# Altium project USB PD Hub.PrjPcb (part 2 of 2)

## Sheet USB7206C.SchDoc
size Tabloid; SheetNumber: 4; SheetTotal: 8
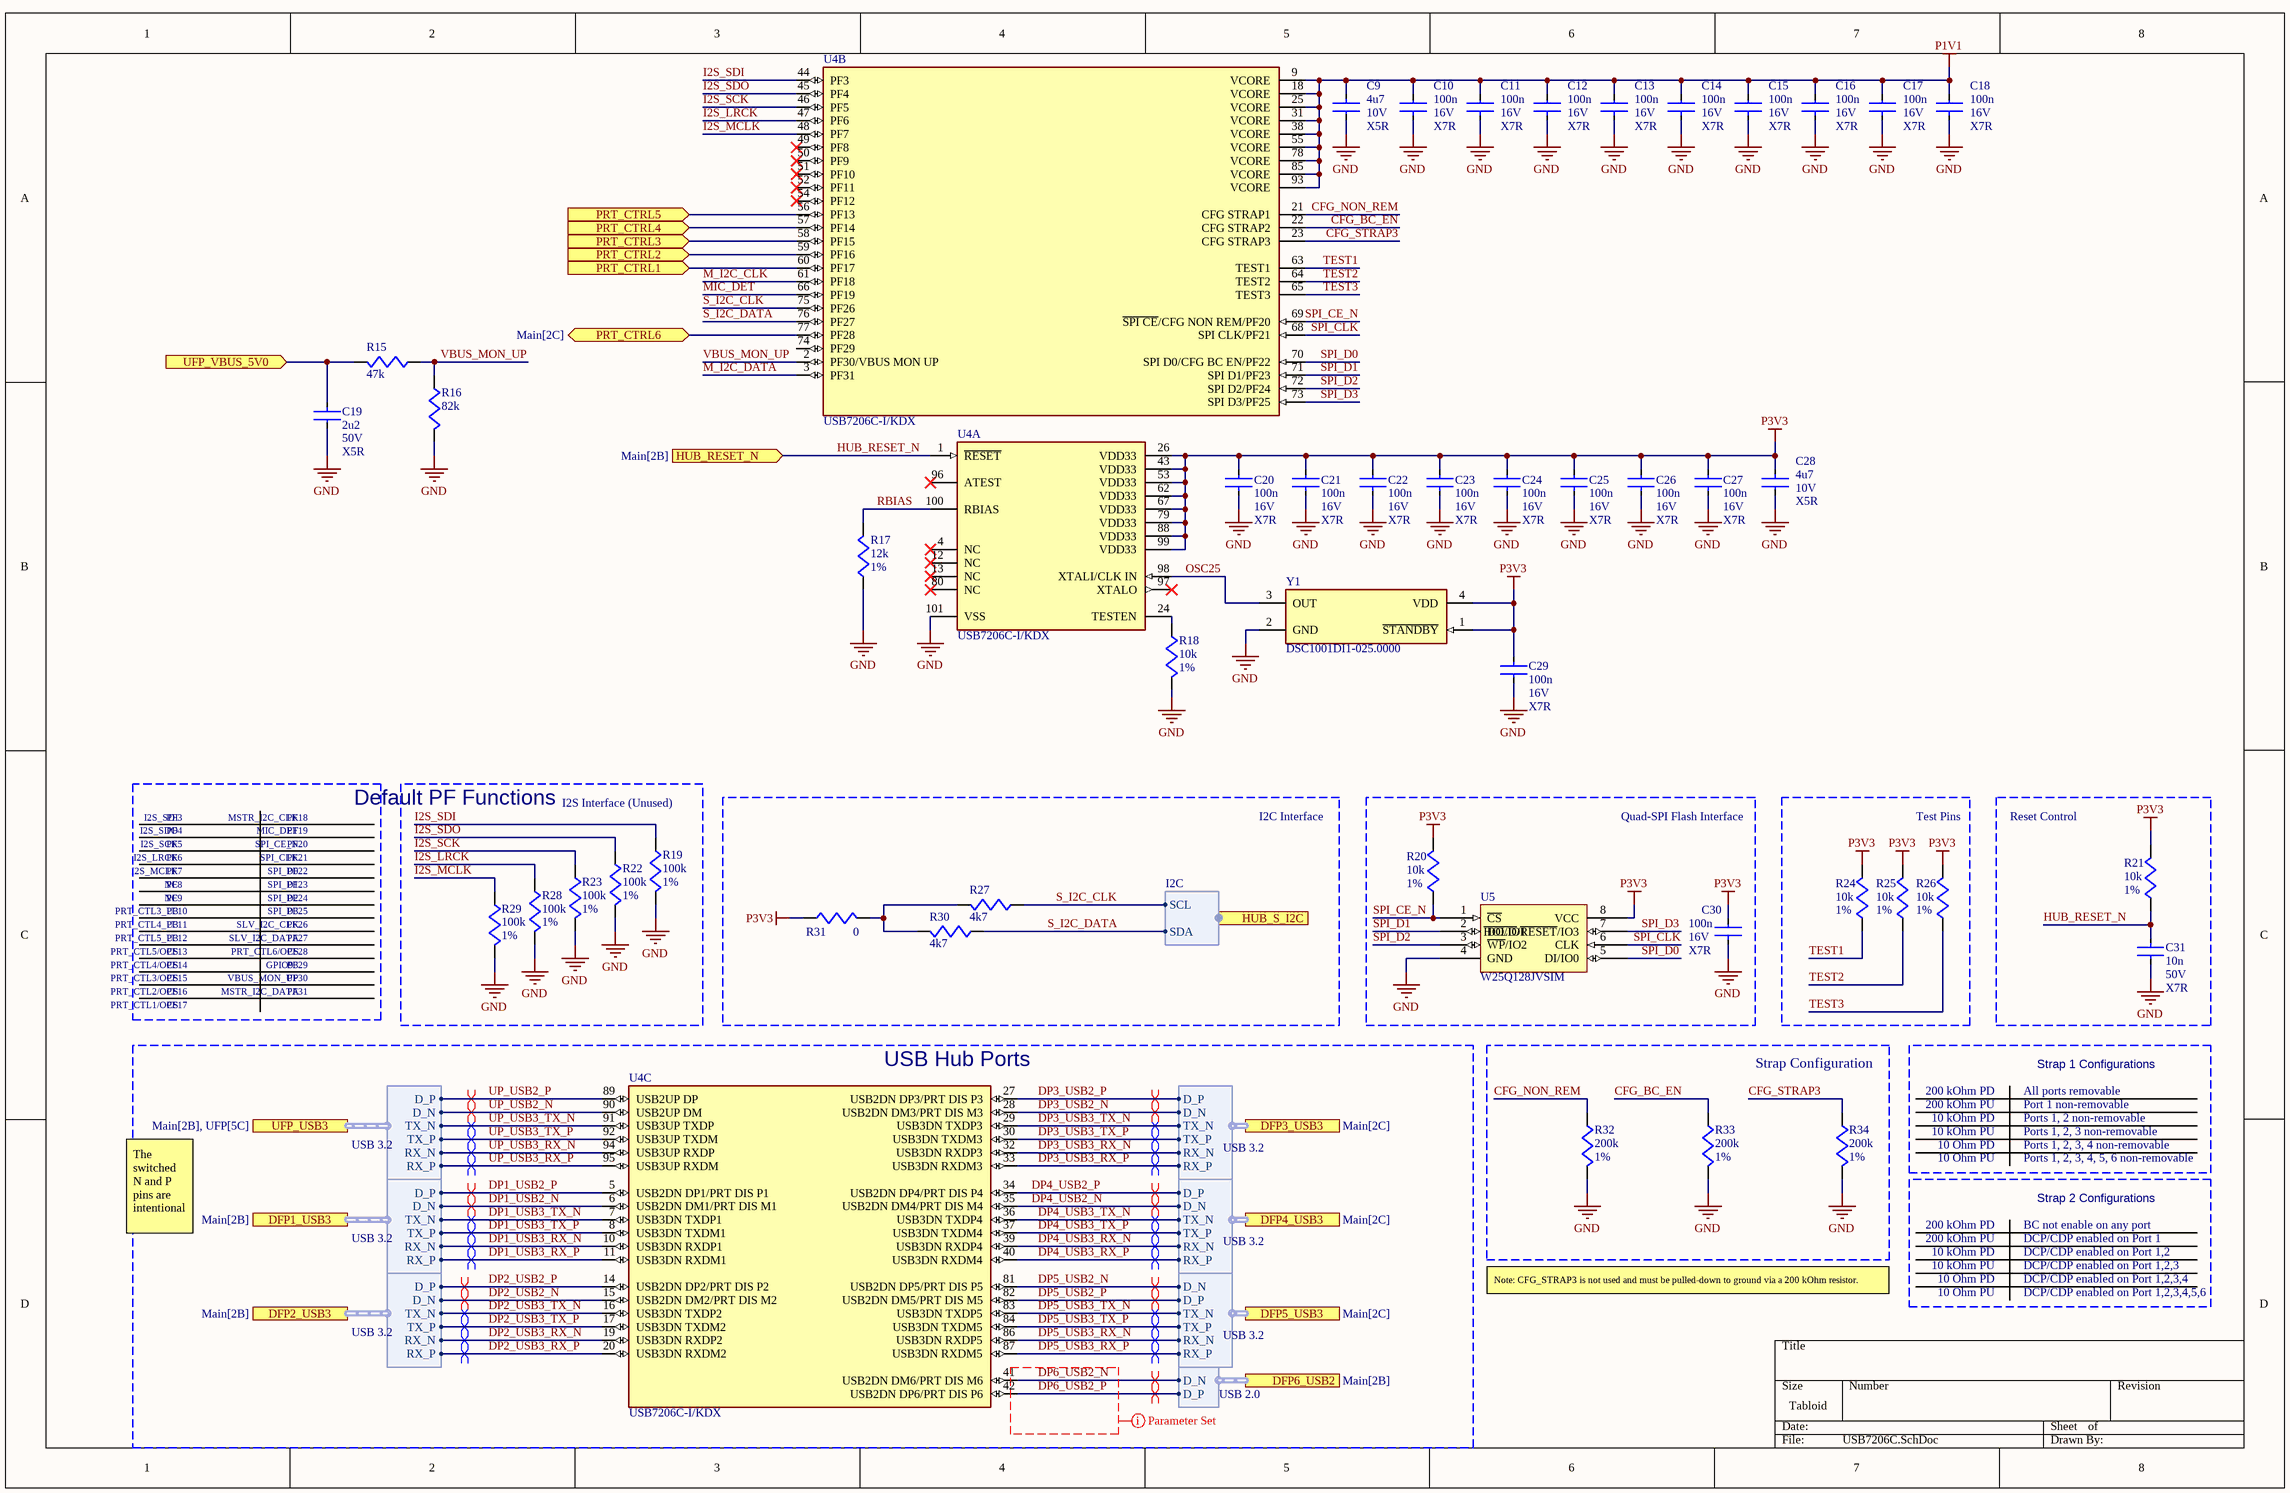
[diagram p6: USB7206C.SchDoc]

### Parts
C9  value 4u7  Voltage: 10V  Dielectric: X5R  [CAPC1005X06N]  (hidden comment: 4.7uF 10V 0402)
C10  value 100n  Voltage: 16V  Dielectric: X7R  [CAPC1005X06N]  (hidden comment: 100nF 16V 0402)
C11  value 100n  Voltage: 16V  Dielectric: X7R  [CAPC1005X06N]  (hidden comment: 100nF 16V 0402)
C12  value 100n  Voltage: 16V  Dielectric: X7R  [CAPC1005X06N]  (hidden comment: 100nF 16V 0402)
C13  value 100n  Voltage: 16V  Dielectric: X7R  [CAPC1005X06N]  (hidden comment: 100nF 16V 0402)
C14  value 100n  Voltage: 16V  Dielectric: X7R  [CAPC1005X06N]  (hidden comment: 100nF 16V 0402)
C15  value 100n  Voltage: 16V  Dielectric: X7R  [CAPC1005X06N]  (hidden comment: 100nF 16V 0402)
C16  value 100n  Voltage: 16V  Dielectric: X7R  [CAPC1005X06N]  (hidden comment: 100nF 16V 0402)
C17  value 100n  Voltage: 16V  Dielectric: X7R  [CAPC1005X06N]  (hidden comment: 100nF 16V 0402)
C18  value 100n  Voltage: 16V  Dielectric: X7R  [CAPC1005X06N]  (hidden comment: 100nF 16V 0402)
C19  value 2u2  Voltage: 50V  Dielectric: X5R  [CAPC2012X14N]  (hidden comment: 2.2uF 50V 0805)
C20  value 100n  Voltage: 16V  Dielectric: X7R  [CAPC1005X06N]  (hidden comment: 100nF 16V 0402)
C21  value 100n  Voltage: 16V  Dielectric: X7R  [CAPC1005X06N]  (hidden comment: 100nF 16V 0402)
C22  value 100n  Voltage: 16V  Dielectric: X7R  [CAPC1005X06N]  (hidden comment: 100nF 16V 0402)
C23  value 100n  Voltage: 16V  Dielectric: X7R  [CAPC1005X06N]  (hidden comment: 100nF 16V 0402)
C24  value 100n  Voltage: 16V  Dielectric: X7R  [CAPC1005X06N]  (hidden comment: 100nF 16V 0402)
C25  value 100n  Voltage: 16V  Dielectric: X7R  [CAPC1005X06N]  (hidden comment: 100nF 16V 0402)
C26  value 100n  Voltage: 16V  Dielectric: X7R  [CAPC1005X06N]  (hidden comment: 100nF 16V 0402)
C27  value 100n  Voltage: 16V  Dielectric: X7R  [CAPC1005X06N]  (hidden comment: 100nF 16V 0402)
C28  value 4u7  Voltage: 10V  Dielectric: X5R  [CAPC1005X06N]  (hidden comment: 4.7uF 10V 0402)
C29  value 100n  Voltage: 16V  Dielectric: X7R  [CAPC1005X06N]  (hidden comment: 100nF 16V 0402)
C30  value 100n  Voltage: 16V  Dielectric: X7R  [CAPC1005X06N]  (hidden comment: 100nF 16V 0402)
C31  value 10n  Voltage: 50V  Dielectric: X7R  [CAPC1005X06N]  (hidden comment: 10n 50V X7R 0402)
R15  value 47k  [RESC1005X04M]  (hidden comment: 47k 1% 0402)
R16  value 82k  [RESC1005X04M]  (hidden comment: 82k 1% 0402)
R17  value 12k  Tolerance: 1%  [RESC1005X04M]  (hidden comment: 12k 1% 0402)
R18  value 10k  Tolerance: 1%  [RESC1005X04M]  (hidden comment: 10k 1% 0402)
R19  value 100k  Tolerance: 1%  [RESC1005X04M]  (hidden comment: 100k 1% 0402)
R20  value 10k  Tolerance: 1%  [RESC1005X04M]  (hidden comment: 10k 1% 0402)
R21  value 10k  Tolerance: 1%  [RESC1005X04M]  (hidden comment: 10k 1% 0402)
R22  value 100k  Tolerance: 1%  [RESC1005X04M]  (hidden comment: 100k 1% 0402)
R23  value 100k  Tolerance: 1%  [RESC1005X04M]  (hidden comment: 100k 1% 0402)
R24  value 10k  Tolerance: 1%  [RESC1005X04M]  (hidden comment: 10k 1% 0402)
R25  value 10k  Tolerance: 1%  [RESC1005X04M]  (hidden comment: 10k 1% 0402)
R26  value 10k  Tolerance: 1%  [RESC1005X04M]  (hidden comment: 10k 1% 0402)
R27  value 4k7  [RESC1005X04M]  (hidden comment: 4.7k 5% 0402)
R28  value 100k  Tolerance: 1%  [RESC1005X04M]  (hidden comment: 100k 1% 0402)
R29  value 100k  Tolerance: 1%  [RESC1005X04M]  (hidden comment: 100k 1% 0402)
R30  value 4k7  [RESC1005X04M]  (hidden comment: 4.7k 5% 0402)
R31  value 0  [RESC1508X05M]  (hidden comment: 0 Ohm 1% 0603)
R32  value 200k  Tolerance: 1%  [RESC1005X04M]  (hidden comment: 200k 1% 0402)
R33  value 200k  Tolerance: 1%  [RESC1005X04M]  (hidden comment: 200k 1% 0402)
R34  value 200k  Tolerance: 1%  [RESC1005X04M]  (hidden comment: 200k 1% 0402)
U4  USB7206C-I/KDX  [FP-C04-407-IPC_A]  (parts A,B,C of 3)
U5  W25Q128JVSIM  [SOIC127P790X216-8N]
Y1  DSC1001DI1-025.0000  [FP-CDFN2520-4LD-PL-1-MFG]

### Blocks framed on the sheet
I2S Interface (Unused): R19 R22 R23 R28 R29
I2C Interface: R27 R30 R31
Quad-SPI Flash Interface: C30 R20 U5
Test Pins: R24-R26
Reset Control: C31 R21
USB Hub Ports: U4
Strap Configuration: R32-R34

### Ports
DFP1_USB3 (harness USB 3.2, see Main[2B]), DFP2_USB3 (harness USB 3.2, see Main[2B]), DFP3_USB3 (harness USB 3.2, see Main[2C]), DFP4_USB3 (harness USB 3.2, see Main[2C]), DFP5_USB3 (harness USB 3.2, see Main[2C]), DFP6_USB2 (harness USB 2.0, see Main[2B]), HUB_RESET_N (in, see Main[2B]), HUB_S_I2C (harness I2C, see Main[2B]), PRT_CTRL1 (in, see Main[2B]), PRT_CTRL2 (in, see Main[2B]), PRT_CTRL3 (in, see Main[2C]), PRT_CTRL4 (in, see Main[2C]), PRT_CTRL5 (in, see Main[2C]), PRT_CTRL6 (bidir, see Main[2C]), UFP_USB3 (harness USB 3.2, see Main[2B], UFP[5C]), UFP_VBUS_5V0 (in, see Main[2B], UFP[2B])

### Harnesses
USB 3.2: TX_N, TX_P, D_P, D_N, RX_N, RX_P
USB 3.2: TX_N, RX_N, TX_P, RX_P, D_N, D_P
USB 3.2: D_P, D_N, TX_N, RX_N, TX_P, RX_P
USB 3.2: D_P, D_N, TX_P, RX_P, RX_N, TX_N
USB 2.0: D_P, D_N
I2C: SCL, SDA
USB 3.2: D_N, TX_N, RX_N, TX_P, D_P, RX_P

### Nets
GND: C9.2 C10.1 C11.1 C12.1 C13.1 C14.1 C15.1 C16.1 C17.1 C18.1 C19.2 C20.1 C21.1 C22.1 C23.1 C24.1 C25.1 C26.1 C27.1 C28.2 C29.2 C30.1 C31.2 R16.1 R17.2 R18.1 R19.2 R22.2 R23.2 R28.2 R29.2 R32.2 R33.2 R34.2 U4.101(VSS) U5.4(GND) Y1.2(GND)
P1V1: C9.1 C10.2 C11.2 C12.2 C13.2 C14.2 C15.2 C16.2 C17.2 C18.2 U4.9(VCORE) U4.18(VCORE) U4.25(VCORE) U4.31(VCORE) U4.38(VCORE) U4.55(VCORE) U4.78(VCORE) U4.85(VCORE) U4.93(VCORE)
P3V3: C20.2 C21.2 C22.2 C23.2 C24.2 C25.2 C26.2 C27.2 C28.1 C29.1 C30.2 R20.2 R21.2 R24.2 R25.2 R26.2 R31.1 U4.26(VDD33) U4.43(VDD33) U4.53(VDD33) U4.62(VDD33) U4.67(VDD33) U4.79(VDD33) U4.88(VDD33) U4.99(VDD33) U5.8(VCC) Y1.1(~{STANDBY}) Y1.4(VDD)
P5V0_UFP: C19.1 R15.1 ; port UFP_VBUS_5V0
CFG_BC_EN: R33.1 U4.22(CFG_STRAP2)
CFG_NON_REM: R32.1 U4.21(CFG_STRAP1)
CFG_STRAP3: R34.1 U4.23(CFG_STRAP3)
DP1_USB2_N: U4.6(USB2DN_DM1/PRT_DIS_M1) ; port DFP1_USB3.D_N
DP1_USB2_P: U4.5(USB2DN_DP1/PRT_DIS_P1) ; port DFP1_USB3.D_P
DP1_USB3_RX_N: U4.10(USB3DN_RXDP1) ; port DFP1_USB3.RX_N
DP1_USB3_RX_P: U4.11(USB3DN_RXDM1) ; port DFP1_USB3.RX_P
DP1_USB3_TX_N: U4.7(USB3DN_TXDP1) ; port DFP1_USB3.TX_N
DP1_USB3_TX_P: U4.8(USB3DN_TXDM1) ; port DFP1_USB3.TX_P
DP2_USB2_N: U4.15(USB2DN_DM2/PRT_DIS_M2) ; port DFP2_USB3.D_N
DP2_USB2_P: U4.14(USB2DN_DP2/PRT_DIS_P2) ; port DFP2_USB3.D_P
DP2_USB3_RX_N: U4.19(USB3DN_RXDP2) ; port DFP2_USB3.RX_N
DP2_USB3_RX_P: U4.20(USB3DN_RXDM2) ; port DFP2_USB3.RX_P
DP2_USB3_TX_N: U4.16(USB3DN_TXDP2) ; port DFP2_USB3.TX_N
DP2_USB3_TX_P: U4.17(USB3DN_TXDM2) ; port DFP2_USB3.TX_P
DP3_USB2_N: U4.28(USB2DN_DM3/PRT_DIS_M3) ; port DFP3_USB3.D_N
DP3_USB2_P: U4.27(USB2DN_DP3/PRT_DIS_P3) ; port DFP3_USB3.D_P
DP3_USB3_RX_N: U4.32(USB3DN_RXDP3) ; port DFP3_USB3.RX_N
DP3_USB3_RX_P: U4.33(USB3DN_RXDM3) ; port DFP3_USB3.RX_P
DP3_USB3_TX_N: U4.29(USB3DN_TXDP3) ; port DFP3_USB3.TX_N
DP3_USB3_TX_P: U4.30(USB3DN_TXDM3) ; port DFP3_USB3.TX_P
DP4_USB2_N: U4.35(USB2DN_DM4/PRT_DIS_M4) ; port DFP4_USB3.D_N
DP4_USB2_P: U4.34(USB2DN_DP4/PRT_DIS_P4) ; port DFP4_USB3.D_P
DP4_USB3_RX_N: U4.39(USB3DN_RXDP4) ; port DFP4_USB3.RX_N
DP4_USB3_RX_P: U4.40(USB3DN_RXDM4) ; port DFP4_USB3.RX_P
DP4_USB3_TX_N: U4.36(USB3DN_TXDP4) ; port DFP4_USB3.TX_N
DP4_USB3_TX_P: U4.37(USB3DN_TXDM4) ; port DFP4_USB3.TX_P
DP5_USB2_N: U4.81(USB2DN_DP5/PRT_DIS_P5) ; port DFP5_USB3.D_N
DP5_USB2_P: U4.82(USB2DN_DM5/PRT_DIS_M5) ; port DFP5_USB3.D_P
DP5_USB3_RX_N: U4.86(USB3DN_RXDP5) ; port DFP5_USB3.RX_N
DP5_USB3_RX_P: U4.87(USB3DN_RXDM5) ; port DFP5_USB3.RX_P
DP5_USB3_TX_N: U4.83(USB3DN_TXDP5) ; port DFP5_USB3.TX_N
DP5_USB3_TX_P: U4.84(USB3DN_TXDM5) ; port DFP5_USB3.TX_P
DP6_USB2_N: U4.41(USB2DN_DM6/PRT_DIS_M6) ; port DFP6_USB2.D_N
DP6_USB2_P: U4.42(USB2DN_DP6/PRT_DIS_P6) ; port DFP6_USB2.D_P
FAULT: U4.60(PF17) ; port PRT_CTRL1
FAULT: U4.59(PF16) ; port PRT_CTRL2  [a separate net that carries the same name]
FAULT: U4.58(PF15) ; port PRT_CTRL3  [a separate net that carries the same name]
FAULT: U4.57(PF14) ; port PRT_CTRL4  [a separate net that carries the same name]
HUB_RESET_N: C31.1 R21.1 U4.1(~{RESET}) ; port HUB_RESET_N
I2S_LRCK: R28.1 U4.47(PF6)
I2S_MCLK: R29.1 U4.48(PF7)
I2S_SCK: R23.1 U4.46(PF5)
I2S_SDI: R19.1 U4.44(PF3)
I2S_SDO: R22.1 U4.45(PF4)
M_I2C_CLK: U4.61(PF18)
M_I2C_DATA: U4.3(PF31)
MIC_DET: U4.66(PF19)
OSC25: U4.98(XTALI/CLK_IN) Y1.3(OUT)
RBIAS: R17.1 U4.100(RBIAS)
S_I2C_CLK: R27.1 U4.75(PF26) ; port HUB_S_I2C.SCL
S_I2C_DATA: R30.1 U4.76(PF27) ; port HUB_S_I2C.SDA
SPI_CE_N: R20.1 U4.69(~{SPI_CE}/CFG_NON_REM/PF20) U5.1(~{CS})
SPI_CLK: U4.68(SPI_CLK/PF21) U5.6(CLK)
SPI_D0: U4.70(SPI_D0/CFG_BC_EN/PF22) U5.5(DI/IO0)
SPI_D1: U4.71(SPI_D1/PF23) U5.2(DO/IO1)
SPI_D2: U4.72(SPI_D2/PF24) U5.3(~{WP}/IO2)
SPI_D3: U4.73(SPI_D3/PF25) U5.7(~{HOLD}/~{RESET}/IO3)
TEST1: R24.1 U4.63(TEST1)
TEST2: R25.1 U4.64(TEST2)
TEST3: R26.1 U4.65(TEST3)
UP_USB2_N: U4.90(USB2UP_DM) ; port UFP_USB3.D_N
UP_USB2_P: U4.89(USB2UP_DP) ; port UFP_USB3.D_P
UP_USB3_RX_N: U4.94(USB3UP_RXDP) ; port UFP_USB3.RX_N
UP_USB3_RX_P: U4.95(USB3UP_RXDM) ; port UFP_USB3.RX_P
UP_USB3_TX_N: U4.91(USB3UP_TXDP) ; port UFP_USB3.TX_N
UP_USB3_TX_P: U4.92(USB3UP_TXDM) ; port UFP_USB3.TX_P
VBUS_MON_UP: R15.2 R16.2 U4.2(PF30/VBUS_MON_UP)
NetR18_2: R18.2 U4.24(TESTEN)
NetR27_2: R27.2 R30.2 R31.2
NetU4_56: U4.56(PF13) ; port PRT_CTRL5
NetU4_77: U4.77(PF28) ; port PRT_CTRL6

Not connected (* = marked no-connect by the designer): U4 4(NC)* 12(NC)* 13(NC)* 49(PF8)* 50(PF9)* 51(PF10)* 52(PF11)* 54(PF12)* 74(PF29) 80(NC)* 96(ATEST)* 97(XTALO)*

### Layout directives
differential pair; differential pair class DIFF90: DP1_USB2_N, DP1_USB2_P, DP1_USB3_RX_N, DP1_USB3_RX_P, DP1_USB3_TX_N, DP1_USB3_TX_P, DP2_USB2_N, DP2_USB2_P, DP2_USB3_RX_N, DP2_USB3_RX_P, DP2_USB3_TX_N, DP2_USB3_TX_P, DP3_USB2_N, DP3_USB2_P, DP3_USB3_RX_N, DP3_USB3_RX_P, DP3_USB3_TX_N, DP3_USB3_TX_P, DP4_USB2_N, DP4_USB2_P, DP4_USB3_RX_N, DP4_USB3_RX_P, DP4_USB3_TX_N, DP4_USB3_TX_P, DP5_USB2_N, DP5_USB2_P, DP5_USB3_RX_N, DP5_USB3_RX_P, DP5_USB3_TX_N, DP5_USB3_TX_P, DP6_USB2_N, DP6_USB2_P, UP_USB2_N, UP_USB2_P, UP_USB3_RX_N, UP_USB3_RX_P, UP_USB3_TX_N, UP_USB3_TX_P
net class USB2: DP6_USB2_N, DP6_USB2_P

### Notes on the sheet
- PF4
- PF5
- PF3
- I2S_SCK
- I2S_SDO
- I2S_SDI
- PF19
- PF20
- PF18
- MSTR_I2C_CLK
- MIC_DET
- SPI_CE_N
- Default PF Functions
- PF7
- PF8
- PF9
- PF6
- I2S_LRCK
- I2S_MCLK
- NC
- PF21
- PF23
- PF24
- PF22
- SPI_CLK
- SPI_D0
- SPI_D1
- SPI_D2
- PF11
- PF12
- PF13
- PF15
- PF14
- PF10
- PRT_CTL3_U3
- PRT_CTL4_U3
- PRT_CTL5_U3
- PRT_CTL5/OCS
- PRT_CTL4/OCS
- PRT_CTL3/OCS
- PF26
- PF27
- PF28
- PF30
- PF29
- PF25
- SPI_D3
- SLV_I2C_CLK
- SLV_I2C_DATA
- PRT_CTL6/OCS
- GPIO93
- VBUS_MON_UP
- PF16
- PF17
- PRT_CTL1/OCS
- PRT_CTL2/OCS
- PF31
- MSTR_I2C_DATA
- 200 kOhm PD
- 200 kOhm PU
- All ports removable
- Port 1 non-removable
- Strap 1 Configurations
- 10 kOhm PD
- 10 kOhm PU
- 10 Ohm PD
- 10 Ohm PU
- Ports 1, 2 non-removable
- Ports 1, 2, 3 non-removable
- Ports 1, 2, 3, 4 non-removable
- Ports 1, 2, 3, 4, 5, 6 non-removable
- The switched N and P pins are intentional
- BC not enable on any port
- DCP/CDP enabled on Port 1
- Strap 2 Configurations
- Note: CFG_STRAP3 is not used and must be pulled-down to ground via a 200 kOhm resistor.
- DCP/CDP enabled on Port 1,2
- DCP/CDP enabled on Port 1,2,3
- DCP/CDP enabled on Port 1,2,3,4
- DCP/CDP enabled on Port 1,2,3,4,5,6

### Library data of the parts
C9 C28 = CMP-001-00117-1: 10V 4.7uF X5R ±10% 0402 Multilayer Ceramic Capacitors MLCC - SMD/SMT ROHS; LCSC Part #: C368809; Package: 0402
C10-C18 C20-C27 C29 C30 = CMP-001-00088-1: 16V 100nF X7R ±10% 0402 Multilayer Ceramic Capacitors MLCC - SMD/SMT ROHS; LCSC Part #: C1525; Package: 0402
C19 = CMP-001-00094-2: 50V 2.2uF X5R ±10% 0805 Multilayer Ceramic Capacitors MLCC - SMD/SMT ROHS; Package: 0805; LCSC Part #: C377773
C31 = CMP-001-00116-1: 50V 10nF X7R ±10% 0402 Multilayer Ceramic Capacitors MLCC - SMD/SMT ROHS; LCSC Part #: C60133; Package: 0402
R15 = CMP-009-00226-1: 62.5mW Thick Film Resistors 50V ±100ppm/℃ ±5% 47kΩ 0402 Chip Resistor - Surface Mount ROHS; Tolerance: 1%; LCSC Part #: C163440; Package: 0402
R16 = CMP-009-00227-1: 62.5mW Thick Film Resistors 50V ±100ppm/℃ ±1% 82kΩ 0402 Chip Resistor - Surface Mount ROHS; Tolerance: 1%; LCSC Part #: C137932; Package: 0402
R17 = CMP-009-00219-1: 62.5mW Thick Film Resistors 50V ±100ppm/℃ ±1% 12kΩ 0402 Chip Resistor - Surface Mount ROHS; LCSC Part #: C114760; Package: 0402
R18 R20 R21 R24-R26 = CMP-009-00187-1: 62.5mW Thick Film Resistors 50V ±100ppm/℃ ±1% 10kΩ 0402 Chip Resistor - Surface Mount ROHS; LCSC Part #: C60490; Package: 0402
R19 R22 R23 R28 R29 = CMP-009-00218-1: 62.5mW Thick Film Resistors 50V ±100ppm/℃ ±1% 100kΩ 0402 Chip Resistor - Surface Mount ROHS; LCSC Part #: C60491; Package: 0402
R27 R30 = CMP-009-00197-1: 62.5mW Thick Film Resistors 50V ±100ppm/℃ ±5% 4.7kΩ 0402 Chip Resistor - Surface Mount ROHS; Tolerance: 5%; Package: 0402; LCSC Part #: C105870
R31 = CMP-009-00190-2: 62.5mW Thick Film Resistors 50V 0Ω 0402 Chip Resistor - Surface Mount ROHS; Tolerance: 1%; Package: 0603; LCSC Part #: C60485
R32-R34 = CMP-009-00220-1: 62.5mW Thick Film Resistors 50V ±100ppm/℃ ±1% 200kΩ 0402 Chip Resistor - Surface Mount ROHS; Populated: Yes; Package: 0402; LCSC Part #: C114763
U4 = CMP-001-0012-2: USB3.1 GEN2 Hub_no Pd_no Type C 100 VQFN 12X12X0.9MM Tray Rohs Compliant: Yes; Interface: I2C,SPI,USB,I2S,SMBus; Max Supply Voltage: 3.6V; Min Supply Voltage: 1.09V; Max Operating Temperature: 85°C; Min Operating Temperature: -40°C; Height: 900um
U5 = CMP-019-00052-3: NOR Flash Serial (SPI, Dual SPI, Quad SPI) 3V/3.3V 128M-bit 16M x 8 6ns 8-Pin SOIC Tube
Y1 = CMP-06255-000046-1: MEMS OSC XO 25.0000MHZ CMOS SMD; Max Supply Current: 6.3mA; Load Capacitance: 15pF; Max Duty Cycle: 55%; Min Supply Voltage: 1.7V; Frequency Stability: 50ppm; Frequency: 25MHz; Operating Supply Voltage: 3.3V; Max Supply Voltage: 3.6V; Packaging: Rail/Tube; RoHS Compliant: Yes; Length: 0.098inch; Ratings: AEC-Q100; Mount: Surface Mount; Case/Package: SMD/SMT; Width: 0.079inch; Package Quantity: 140; Min Operating Temperature: -40°C; Max Operating Temperature: 85°C; Series: DSC1001; Termination: Solder; Height: 0.035inch

## Sheet PowerSheet.SchDoc
size B; SheetNumber: 2; SheetTotal: 8
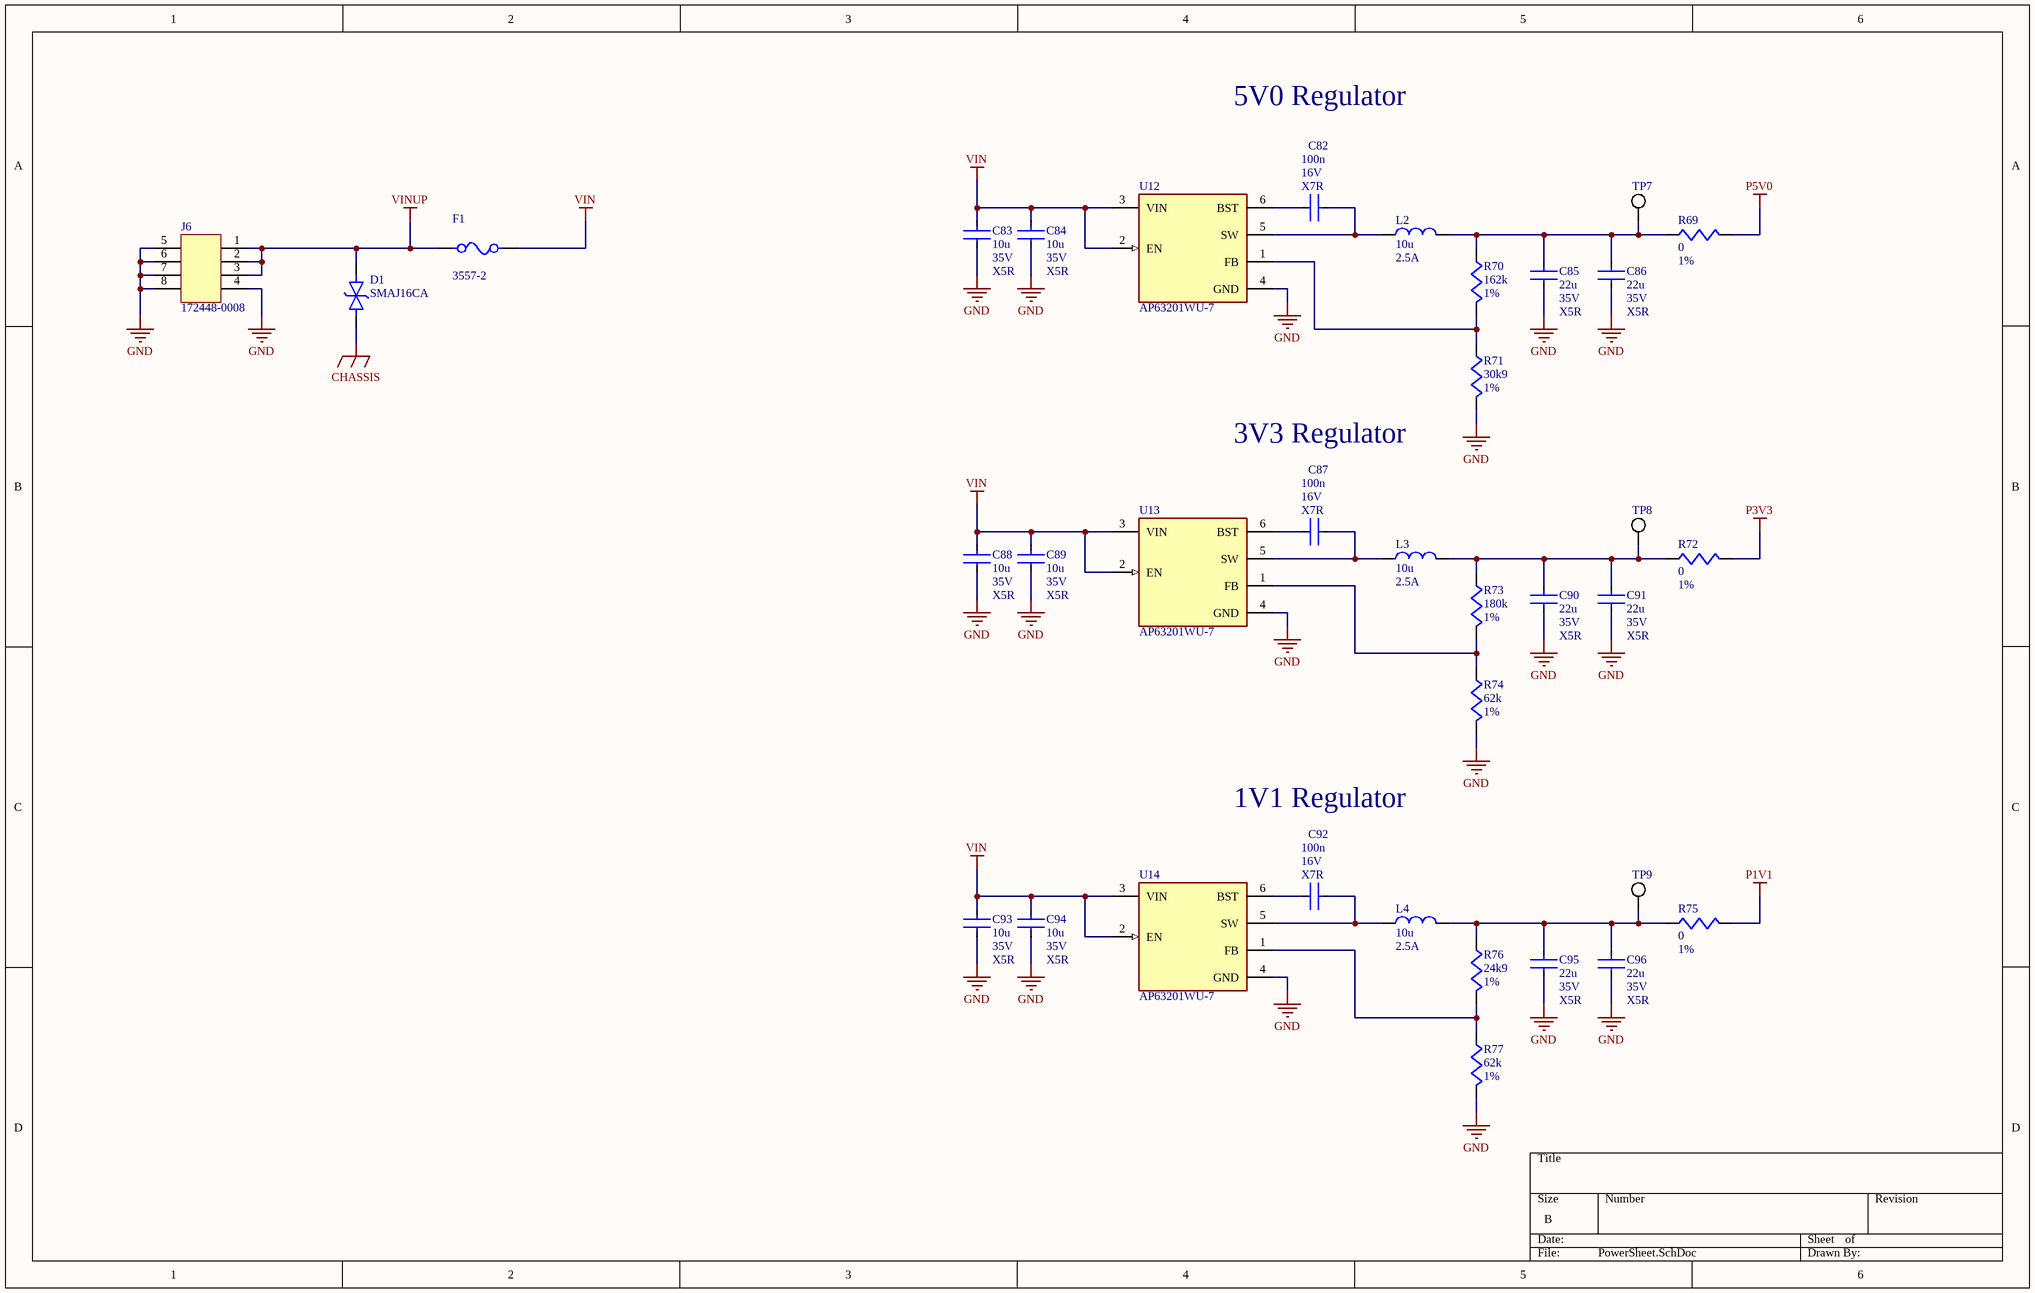
[diagram p7: PowerSheet.SchDoc]

### Parts
C82  value 100n  Voltage: 16V  Dielectric: X7R  [CAPC1005X06N]  (hidden comment: 100nF 16V 0402)
C83  value 10u  Voltage: 35V  Dielectric: X5R  [CAPC1608X08N]  (hidden comment: 10uF 35V 0603)
C84  value 10u  Voltage: 35V  Dielectric: X5R  [CAPC1608X08N]  (hidden comment: 10uF 35V 0603)
C85  value 22u  Voltage: 35V  Dielectric: X5R  [CAPC3225X18N]  (hidden comment: 22uF 35V 1210 X5R)
C86  value 22u  Voltage: 35V  Dielectric: X5R  [CAPC3225X18N]  (hidden comment: 22uF 35V 1210 X5R)
C87  value 100n  Voltage: 16V  Dielectric: X7R  [CAPC1005X06N]  (hidden comment: 100nF 16V 0402)
C88  value 10u  Voltage: 35V  Dielectric: X5R  [CAPC1608X08N]  (hidden comment: 10uF 35V 0603)
C89  value 10u  Voltage: 35V  Dielectric: X5R  [CAPC1608X08N]  (hidden comment: 10uF 35V 0603)
C90  value 22u  Voltage: 35V  Dielectric: X5R  [CAPC3225X18N]  (hidden comment: 22uF 35V 1210 X5R)
C91  value 22u  Voltage: 35V  Dielectric: X5R  [CAPC3225X18N]  (hidden comment: 22uF 35V 1210 X5R)
C92  value 100n  Voltage: 16V  Dielectric: X7R  [CAPC1005X06N]  (hidden comment: 100nF 16V 0402)
C93  value 10u  Voltage: 35V  Dielectric: X5R  [CAPC1608X08N]  (hidden comment: 10uF 35V 0603)
C94  value 10u  Voltage: 35V  Dielectric: X5R  [CAPC1608X08N]  (hidden comment: 10uF 35V 0603)
C95  value 22u  Voltage: 35V  Dielectric: X5R  [CAPC3225X18N]  (hidden comment: 22uF 35V 1210 X5R)
C96  value 22u  Voltage: 35V  Dielectric: X5R  [CAPC3225X18N]  (hidden comment: 22uF 35V 1210 X5R)
D1  SMAJ16CA  [DO-214AC]
F1  3557-2  [3557-2-Footprint-1]
J6  172448-0008  [FP-172448-0008-MFG]
L2  value 10u  Saturation Current: 2.5A  [10uH 2.5A SL0420-100M-Footprint-1]  (hidden comment: 10uH 2.5A SL0420-100M)
L3  value 10u  Saturation Current: 2.5A  [10uH 2.5A SL0420-100M-Footprint-1]  (hidden comment: 10uH 2.5A SL0420-100M)
L4  value 10u  Saturation Current: 2.5A  [10uH 2.5A SL0420-100M-Footprint-1]  (hidden comment: 10uH 2.5A SL0420-100M)
R69  value 0  Tolerance: 1%  [RESC2013X06M]  (hidden comment: 0 Ohm 1% 0805)
R70  value 162k  Tolerance: 1%  [RESC1005X04M]  (hidden comment: 162k 1% 0402)
R71  value 30k9  Tolerance: 1%  [RESC1005X04M]  (hidden comment: 30.9k 1% 0402)
R72  value 0  Tolerance: 1%  [RESC2013X06M]  (hidden comment: 0 Ohm 1% 0805)
R73  value 180k  Tolerance: 1%  [RESC1005X04M]  (hidden comment: 180k 1% 0402)
R74  value 62k  Tolerance: 1%  [RESC1005X04M]  (hidden comment: 62k 1% 0402)
R75  value 0  Tolerance: 1%  [RESC2013X06M]  (hidden comment: 0 Ohm 1% 0805)
R76  value 24k9  Tolerance: 1%  [RESC1005X04M]  (hidden comment: 24.9k 1% 0402)
R77  value 62k  Tolerance: 1%  [RESC1005X04M]  (hidden comment: 62k 1% 0402)
TP7  SMT Test Point 5015  [New footprint 1]  (value not drawn)
TP8  SMT Test Point 5015  [New footprint 1]  (value not drawn)
TP9  SMT Test Point 5015  [New footprint 1]  (value not drawn)
U12  AP63201WU-7  [FP-TSOT26-IPC_B]
U13  AP63201WU-7  [FP-TSOT26-IPC_B]
U14  AP63201WU-7  [FP-TSOT26-IPC_B]

### Nets
CHASSIS: D1.2
GND: C83.2 C84.2 C85.2 C86.2 C88.2 C89.2 C90.2 C91.2 C93.2 C94.2 C95.2 C96.2 J6.4 J6.5 J6.6 J6.7 J6.8 R71.2 R74.2 R77.2 U12.4(GND) U13.4(GND) U14.4(GND)
P1V1: R75.2
P3V3: R72.2
P5V0: R69.2
VIN: C83.1 C84.1 C88.1 C89.1 C93.1 C94.1 F1.2 U12.2(EN) U12.3(VIN) U13.2(EN) U13.3(VIN) U14.2(EN) U14.3(VIN)
VINUP: D1.1 F1.1 J6.1 J6.2 J6.3
NetC82_1: C82.1 L2.1 U12.5(SW)
NetC82_2: C82.2 U12.6(BST)
NetC85_1: C85.1 C86.1 L2.2 R69.1 R70.1 TP7.0
NetC87_1: C87.1 L3.1 U13.5(SW)
NetC87_2: C87.2 U13.6(BST)
NetC90_1: C90.1 C91.1 L3.2 R72.1 R73.1 TP8.0
NetC92_1: C92.1 L4.1 U14.5(SW)
NetC92_2: C92.2 U14.6(BST)
NetC95_1: C95.1 C96.1 L4.2 R75.1 R76.1 TP9.0
NetR70_2: R70.2 R71.1 U12.1(FB)
NetR73_2: R73.2 R74.1 U13.1(FB)
NetR76_2: R76.2 R77.1 U14.1(FB)

### Notes on the sheet
- 5V0 Regulator
- 3V3 Regulator
- 1V1 Regulator

### Library data of the parts
C82 C87 C92 = CMP-001-00088-2: 16V 100nF X7R ±10% 0402 Multilayer Ceramic Capacitors MLCC - SMD/SMT ROHS; LCSC Part #: C1525; Package: 0402
C83 C84 C88 C89 C93 C94 = CMP-001-00102-2: 35V 10uF X5R ±20% 0603 Multilayer Ceramic Capacitors MLCC - SMD/SMT ROHS; LCSC Part #: C194427; Package: 0603
C85 C86 C90 C91 C95 C96 = CMP-001-00092-2: 35V 22uF X5R ±20% 1210 Multilayer Ceramic Capacitors MLCC - SMD/SMT ROHS; Package: 1210; LCSC Part #: C778721
D1 = CMP-004-00043-1: 26V 17.8V Bidirectional 16V SMA(DO-214AC) ESD and Surge Protection (TVS/ESD) ROHS
F1 = CMP-00030-00001-1: Fuse Block 30 A 500V 1 Circuit Blade Through Hole; LCSC Part #: C19727304
J6 = CMP-002-00125-2: Rectangular Power Connector, 8 Contact(s), Male, Solder Terminal; Connector Type: Power,Rectangular; RoHS Compliant: Yes; Mounting Technology: Board
L2-L4 = CMP-006-00023-1: 2A 10uH ±20% 2.5A SMD,4.5x4.1mm Inductors (SMD) ROHS; Footprint: 4.5mmx4.1mm
R69 R72 R75 = CMP-009-00237-1: 125mW Thick Film Resistors 150V ±5% 0Ω 0805 Chip Resistor - Surface Mount ROHS; LCSC Part #: C96345; Package: 0805
R70 = CMP-009-00217-3: 62.5mW Thick Film Resistors 50V ±100ppm/℃ ±1% 162kΩ 0402 Chip Resistor - Surface Mount ROHS; LCSC Part #: C54068; Package: 0402
R71 = CMP-009-00214-2: 62.5mW Thick Film Resistors 50V ±100ppm/℃ ±1% 30.9kΩ 0402 Chip Resistor - Surface Mount ROHS; LCSC Part #: C185428; Package: 0402
R73 = CMP-009-00238-1: 62.5mW Thick Film Resistors 50V ±100ppm/℃ ±1% 180kΩ 0402 Chip Resistor - Surface Mount ROHS; LCSC Part #: C144794; Package: 0402
R74 R77 = CMP-009-00239-1: 62.5mW Thick Film Resistors 50V ±100ppm/℃ ±1% 62kΩ 0402 Chip Resistor - Surface Mount ROHS; LCSC Part #: C137950; Package: 0402
R76 = CMP-009-00200-2: 62.5mW Thick Film Resistors 50V ±100ppm/℃ ±1% 24.9kΩ 0402 Chip Resistor - Surface Mount ROHS; LCSC Part #: C25874; Package: 0402
TP7-TP9 = CMP-00030-00002-1: PC Test Point, Miniature Phosphor Bronze Silver Plating Surface Mount Mounting Type; LCSC Part #: C5199798
U12-U14 = CMP-019-00068-1: Switching Regulator; LCSC Part #: C2071044

## Nets that join several sheets
CHASSIS: Main (C8.1 J2.Shell R14.2 U3.2), PORT1 (6 pins), PORT2 (6 pins), PORT3 (6 pins), PORT4 (6 pins), UFP (7 pins), PowerSheet (D1.2)
GND: Main (6 pins), PORT1 (22 pins), PORT1/PD Controller (25 pins), PORT1/PD Regulator (30 pins), PORT2 (22 pins), PORT2/PD Controller (25 pins), PORT2/PD Regulator (30 pins), PORT3 (22 pins), PORT3/PD Controller (25 pins), PORT3/PD Regulator (30 pins), PORT4 (22 pins), PORT4/PD Controller (25 pins), PORT4/PD Regulator (30 pins), UFP (15 pins), STM32F070CBT6 (18 pins), USB7206C (37 pins), PowerSheet (23 pins)
P1V1: USB7206C (19 pins), PowerSheet (R75.2)
P3V3: Main (R9.2 R11.2 R13.2), PORT1 (7 pins), PORT1/PD Controller (R38A.1 U8A.10), PORT2 (7 pins), PORT2/PD Controller (R38B.1), PORT3 (7 pins), PORT3/PD Controller (R38C.1), PORT4 (7 pins), PORT4/PD Controller (R38D.1), UFP (C1.2 R1.2 U2.8), STM32F070CBT6 (11 pins), USB7206C (28 pins), PowerSheet (R72.2)
P5V0: Main (F2.2), PORT1/PD Controller (C45A.1 U8A.25), PORT2/PD Controller (C45B.1 U8B.25), PORT3/PD Controller (C45C.1 U8C.25), PORT4/PD Controller (C45D.1 U8D.25), UFP (C2.2 U2.30), PowerSheet (R69.2)
P5V0_UFP: UFP (6 pins), USB7206C (C19.1 R15.1)
VIN: PORT1/PD Regulator (10 pins), PORT2/PD Regulator (10 pins), PORT3/PD Regulator (10 pins), PORT4/PD Regulator (10 pins), PowerSheet (13 pins)
ADCIN2: Main (R9.1 R10.2), PORT2/PD Controller (U8B.10)
ADCIN2: Main (R11.1 R12.2), PORT3/PD Controller (U8C.10)
ADCIN2: Main (R13.1), PORT4/PD Controller (U8D.10)
CC1: PORT1 (U6A.12), PORT1/PD Controller (C49A.1 TP1A.0 U8A.24)
CC1: PORT2 (U6B.12), PORT2/PD Controller (C49B.1 TP1B.0 U8B.24)
CC1: PORT3 (U6C.12), PORT3/PD Controller (C49C.1 TP1C.0 U8C.24)
CC1: PORT4 (U6D.12), PORT4/PD Controller (C49D.1 TP1D.0 U8D.24)
CC2: PORT1 (U6A.11), PORT1/PD Controller (C50A.1 TP2A.0 U8A.26)
CC2: PORT2 (U6B.11), PORT2/PD Controller (C50B.1 TP2B.0 U8B.26)
CC2: PORT3 (U6C.11), PORT3/PD Controller (C50C.1 TP2C.0 U8C.26)
CC2: PORT4 (U6D.11), PORT4/PD Controller (C50D.1 TP2D.0 U8D.26)
DIR: PORT1 (U7A.9), PORT1/PD Controller (U8A.16)
DIR: PORT2 (U7B.9), PORT2/PD Controller (U8B.16)
DIR: PORT3 (U7C.9), PORT3/PD Controller (U8C.16)
DIR: PORT4 (U7D.9), PORT4/PD Controller (U8D.16)
DP1_USB2_N: PORT1 (J3A.A7 J3A.B7 U6A.20), USB7206C (U4.6)
DP1_USB2_P: PORT1 (J3A.A6 J3A.B6 U6A.19), USB7206C (U4.5)
DP1_USB3_RX_N: PORT1 (U7A.4), USB7206C (U4.10)
DP1_USB3_RX_P: PORT1 (U7A.3), USB7206C (U4.11)
DP1_USB3_TX_N: PORT1 (U7A.8), USB7206C (U4.7)
DP1_USB3_TX_P: PORT1 (U7A.7), USB7206C (U4.8)
DP2_USB2_N: PORT2 (J3B.A7 J3B.B7 U6B.20), USB7206C (U4.15)
DP2_USB2_P: PORT2 (J3B.A6 J3B.B6 U6B.19), USB7206C (U4.14)
DP2_USB3_RX_N: PORT2 (U7B.4), USB7206C (U4.19)
DP2_USB3_RX_P: PORT2 (U7B.3), USB7206C (U4.20)
DP2_USB3_TX_N: PORT2 (U7B.8), USB7206C (U4.16)
DP2_USB3_TX_P: PORT2 (U7B.7), USB7206C (U4.17)
DP3_USB2_N: PORT3 (J3C.A7 J3C.B7 U6C.20), USB7206C (U4.28)
DP3_USB2_P: PORT3 (J3C.A6 J3C.B6 U6C.19), USB7206C (U4.27)
DP3_USB3_RX_N: PORT3 (U7C.4), USB7206C (U4.32)
DP3_USB3_RX_P: PORT3 (U7C.3), USB7206C (U4.33)
DP3_USB3_TX_N: PORT3 (U7C.8), USB7206C (U4.29)
DP3_USB3_TX_P: PORT3 (U7C.7), USB7206C (U4.30)
DP4_USB2_N: PORT4 (J3D.A7 J3D.B7 U6D.20), USB7206C (U4.35)
DP4_USB2_P: PORT4 (J3D.A6 J3D.B6 U6D.19), USB7206C (U4.34)
DP4_USB3_RX_N: PORT4 (U7D.4), USB7206C (U4.39)
DP4_USB3_RX_P: PORT4 (U7D.3), USB7206C (U4.40)
DP4_USB3_TX_N: PORT4 (U7D.8), USB7206C (U4.36)
DP4_USB3_TX_P: PORT4 (U7D.7), USB7206C (U4.37)
DP5_USB2_N: Main (U3.1), USB7206C (U4.81)
DP5_USB2_P: Main (U3.3), USB7206C (U4.82)
DP5_USB3_RX_N: Main (J2.5), USB7206C (U4.86)
DP5_USB3_RX_P: Main (J2.6), USB7206C (U4.87)
DP5_USB3_TX_N: Main (J2.8), USB7206C (U4.83)
DP5_USB3_TX_P: Main (J2.9), USB7206C (U4.84)
DP6_USB2_N: STM32F070CBT6 (R79.1), USB7206C (U4.41)
DP6_USB2_P: STM32F070CBT6 (R80.1), USB7206C (U4.42)
FAULT: PORT1/PD Controller (U8A.17), USB7206C (U4.60)
FAULT: PORT2/PD Controller (U8B.17), USB7206C (U4.59)
FAULT: PORT3/PD Controller (U8C.17), USB7206C (U4.58)
FAULT: PORT4/PD Controller (U8D.17), USB7206C (U4.57)
I2C1_SCL: PORT1/PD Controller (R40A.2 U8A.27), PORT2/PD Controller (R40B.2 U8B.27), PORT3/PD Controller (R40C.2 U8C.27), PORT4/PD Controller (R40D.2 U8D.27), STM32F070CBT6 (U11.42)
I2C1_SDA: PORT1/PD Controller (R41A.2 U8A.28), PORT2/PD Controller (R41B.2 U8B.28), PORT3/PD Controller (R41C.2 U8C.28), PORT4/PD Controller (R41D.2 U8D.28), STM32F070CBT6 (U11.43)
I2C2_SCL: PORT1/PD Controller (R43A.2 U8A.32), PORT1/PD Regulator (U10A.5)
I2C2_SCL: PORT2/PD Controller (R43B.2 U8B.32), PORT2/PD Regulator (U10B.5)
I2C2_SCL: PORT3/PD Controller (R43C.2 U8C.32), PORT3/PD Regulator (U10C.5)
I2C2_SCL: PORT4/PD Controller (R43D.2 U8D.32), PORT4/PD Regulator (U10D.5)
I2C2_SDA: PORT1/PD Controller (R44A.2 U8A.33), PORT1/PD Regulator (U10A.6)
I2C2_SDA: PORT2/PD Controller (R44B.2 U8B.33), PORT2/PD Regulator (U10B.6)
I2C2_SDA: PORT3/PD Controller (R44C.2 U8C.33), PORT3/PD Regulator (U10C.6)
I2C2_SDA: PORT4/PD Controller (R44D.2 U8D.33), PORT4/PD Regulator (U10D.6)
PPHV: PORT1/PD Controller (C46A.1 U8A.11-12), PORT1/PD Regulator (NT1A.2 R60A.2 R61A.1)
PPHV: PORT2/PD Controller (C46B.1 U8B.11-12), PORT2/PD Regulator (NT1B.2 R60B.2 R61B.1)
PPHV: PORT3/PD Controller (C46C.1 U8C.11-12), PORT3/PD Regulator (NT1C.2 R60C.2 R61C.1)
PPHV: PORT4/PD Controller (C46D.1 U8D.11-12), PORT4/PD Regulator (NT1D.2 R60D.2 R61D.1)
UP_USB2_N: UFP (U1.1), USB7206C (U4.90)
UP_USB2_P: UFP (U1.3), USB7206C (U4.89)
UP_USB3_RX_N: UFP (U2.10), USB7206C (U4.94)
UP_USB3_RX_P: UFP (U2.9), USB7206C (U4.95)
UP_USB3_TX_N: UFP (U2.7), USB7206C (U4.91)
UP_USB3_TX_P: UFP (U2.6), USB7206C (U4.92)
VBUS_PORT1: PORT1 (J3A.A4 J3A.A9 J3A.B4 J3A.B9), PORT1/PD Controller (C47A.1 C48A.1 U8A.3-4 U8A.13-14)
VBUS_PORT2: PORT2 (J3B.A4 J3B.A9 J3B.B4 J3B.B9), PORT2/PD Controller (C47B.1 C48B.1 U8B.3-4 U8B.13-14)
VBUS_PORT3: PORT3 (J3C.A4 J3C.A9 J3C.B4 J3C.B9), PORT3/PD Controller (C47C.1 C48C.1 U8C.3-4 U8C.13-14)
VBUS_PORT4: PORT4 (J3D.A4 J3D.A9 J3D.B4 J3D.B9), PORT4/PD Controller (C47D.1 C48D.1 U8D.3-4 U8D.13-14)

## Assembly variants
Populated: not fitted C? R? R?_PD Regulator1 R?_PD Regulator2 R?_PD Regulator3 R?_PD Regulator4 U? U?_PD Controller1 U?_PD Controller2 U?_PD Controller3 U?_PD Controller4